# EAGLE schematic PDM (EAGLE 6.5.0)
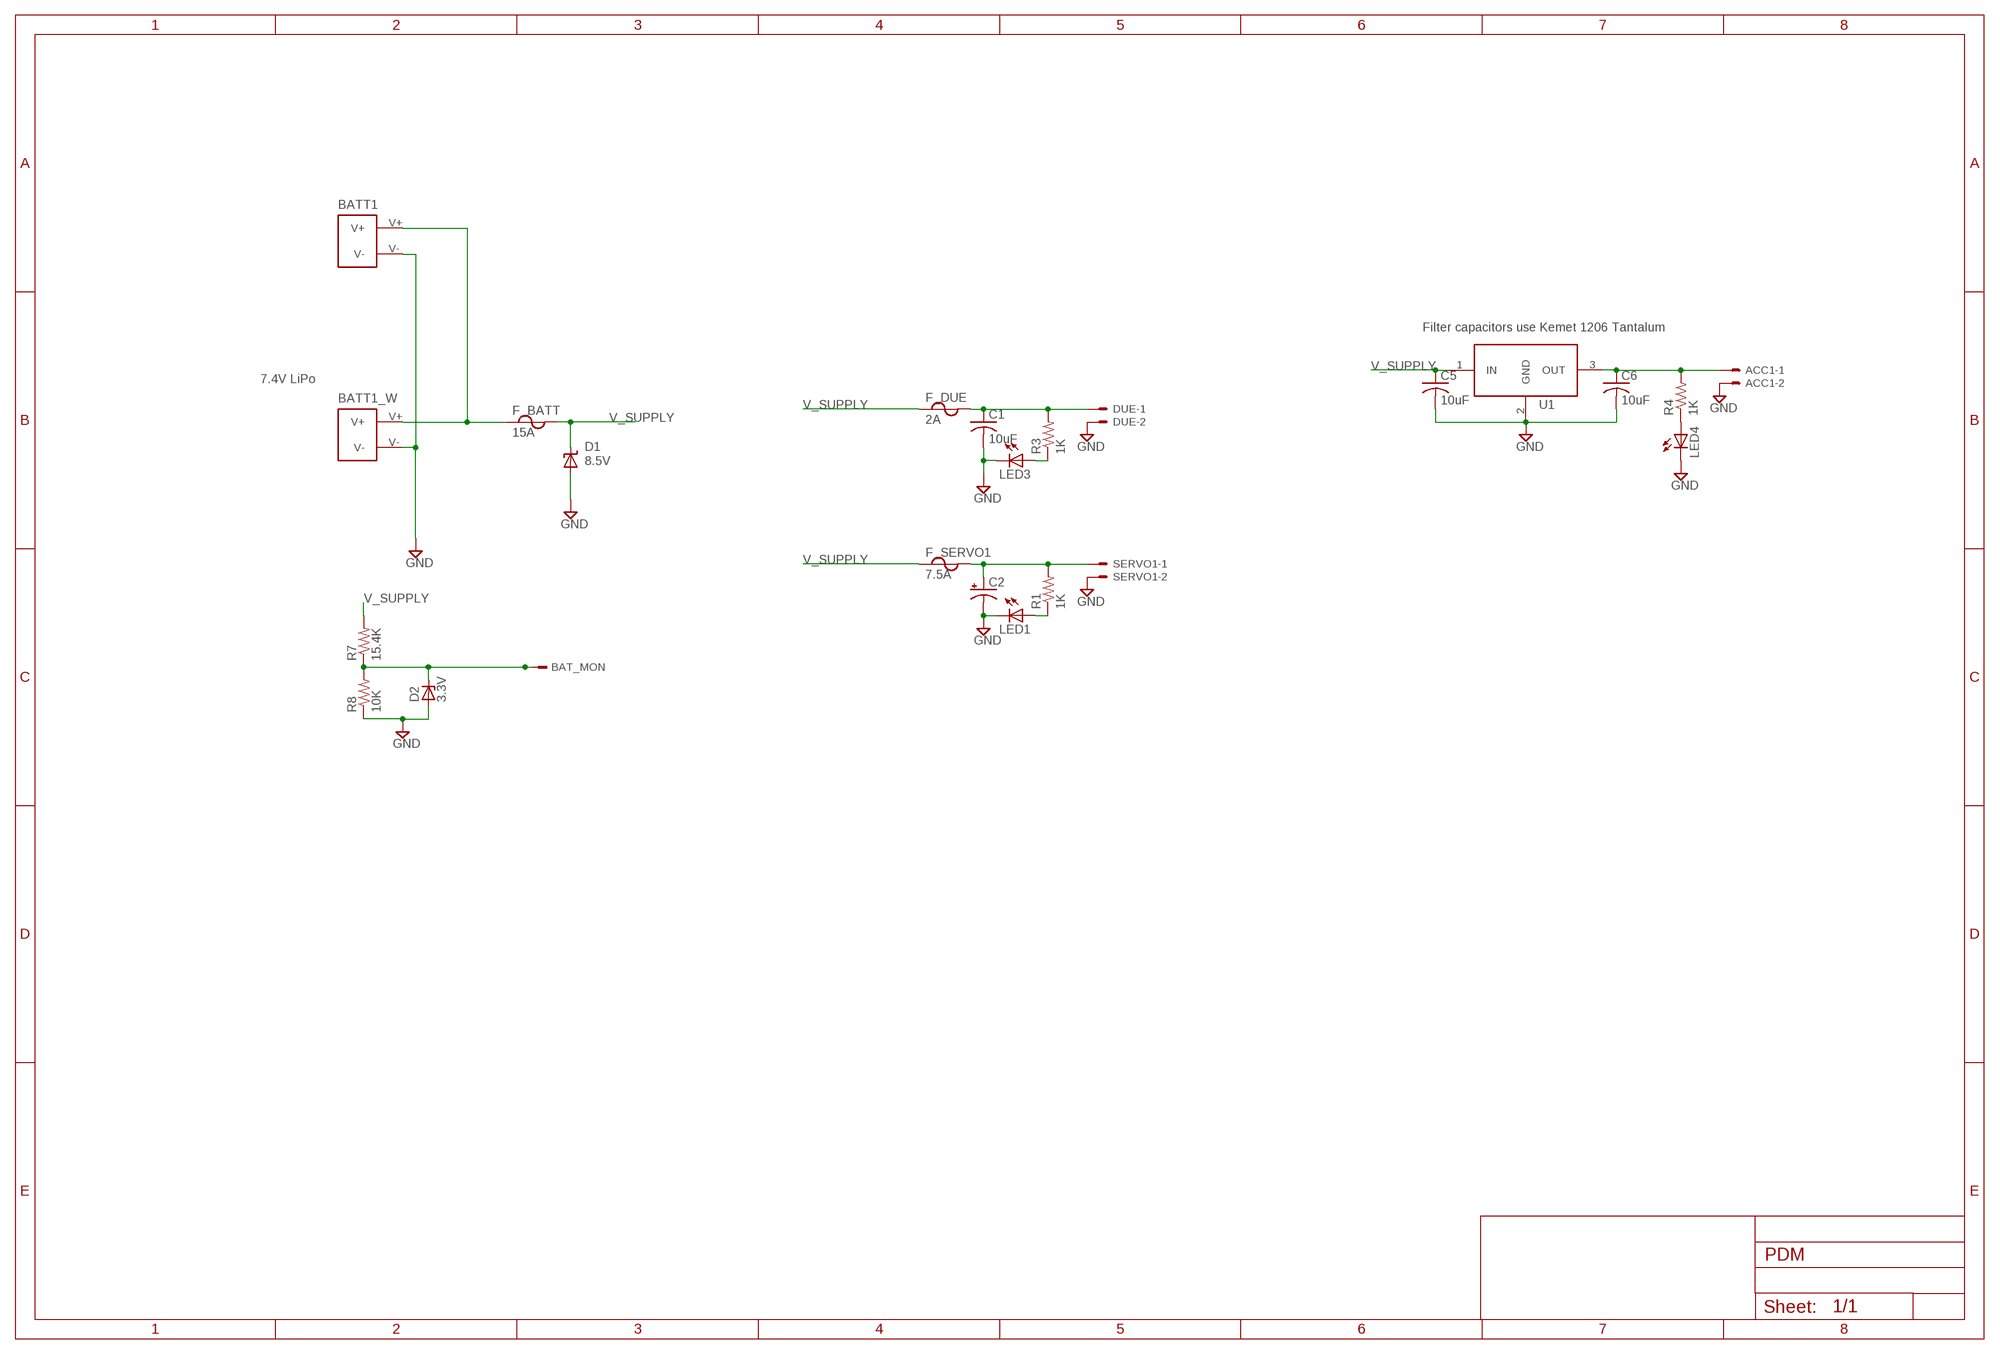
[diagram p0: schematic, sheet 1]

## Parts
ACC1  5566-2  [5566-2]
BAT_MON  TSW-101-02-S-S  [TSW-101-02-S-S]
BATT1  CON_XT60-PCB_MOUNT  [CON_XT60_PCB_MOUNT]
BATT1_W  CON_XT60-PIGTAIL  [CON_XT60_PIGTAIL]
C1  10uF  C-USC1206K  [C1206K]
C2  CPOL-USTT5D11  [TT5D11]
C5  10uF  C-USC1206K  [C1206K]
C6  10uF  C-USC1206K  [C1206K]
D1  8.5V  SUPPRESSOR-SMBJ  [SMBJ]
D2  3.3V  ZENER-DIODESMB  [SMB]
DUE  5566-2  [5566-2]
F_BATT  15A  FUSE-ATO  [ATO]
F_DUE  2A  FUSE-ATO  [ATO]
F_SERVO1  7.5A  FUSE-ATO  [ATO]
LED1  LEDSML1206  [SML1206]
LED3  LEDSML1206  [SML1206]
LED4  LEDSML1206  [SML1206]
R1  1K  R-US_R1206  [R1206]
R3  1K  R-US_R1206  [R1206]
R4  1K  R-US_R1206  [R1206]
R7  15.4K  R-US_R1206  [R1206]
R8  10K  R-US_R1206  [R1206]
SERVO1  5566-2  [5566-2]
U1  MIC29150/29300/29500VERTICAL  [TO220V]

## Nets
GND: ACC1.2 BATT1.V- BATT1_W.V- C1.2 C2.- C5.2 C6.2 D1.A D2.A DUE.2 LED1.C LED3.C LED4.C R8.1 SERVO1.2 U1.2(GND)
N$2: BATT1.V+ BATT1_W.V+ F_BATT.A1 F_BATT.A2 F_BATT.A3 F_BATT.A4
N$4: C1.1 DUE.1 F_DUE.B1 F_DUE.B2 F_DUE.B3 F_DUE.B4 R3.2
N$5: LED1.A R1.1
N$6: ACC1.1 C6.1 R4.2 U1.3(OUT)
N$11: LED3.A R3.1
N$13: LED4.A R4.1
N$15: C2.+ F_SERVO1.B1 F_SERVO1.B2 F_SERVO1.B3 F_SERVO1.B4 R1.2 SERVO1.1
N$18: BAT_MON.1 D2.C R7.1 R8.2
V_SUPPLY: C5.1 D1.C F_BATT.B1 F_BATT.B2 F_BATT.B3 F_BATT.B4 F_DUE.A1 F_DUE.A2 F_DUE.A3 F_DUE.A4 F_SERVO1.A1 F_SERVO1.A2 F_SERVO1.A3 F_SERVO1.A4 R7.2 U1.1(IN)

## Notes on the sheet
- Filter capacitors use Kemet 1206 Tantalum
- 7.4V LiPo

## Library data of the parts
ACC1 DUE SERVO1 = con-molex:5566-2: Mini FIT connector 2 pol Source: http://www.molex.com; OC_FARNELL: 1822072; OC_NEWARK: unknown
BAT_MON = con-samtec:TSW-101-02-S-S: THROUGH-HOLE .025" SQ POST HEADER Source: Samtec TSW.pdf; OC_FARNELL: unknown; OC_NEWARK: unknown
BATT1 BATT1_W = MRSDTeamB:CON_XT60-
C1 C5 C6 = rcl:C-US: CAPACITOR, American symbol
C2 = rcl:CPOL-US: POLARIZED CAPACITOR, American symbol
D1 = MRSDTeamB:SUPPRESSOR-: Suppressor diode
D2 = diode:ZENER-DIODE: Z-Diode
F_BATT F_DUE F_SERVO1 = MRSDTeamB:FUSE-: Automotive Fuse, PCB Mount Digikey <http://www.digikey.com/product-detail/en/178.6165.0002/WK6265-ND/653477> Datasheet <http://www.littelfuse.com/data/en/Data_Sheets/Littelfuse_ATO-PCB-Fuse-holders-178.6765.pdf> Library Part by Nate Chapman
LED1 LED3 LED4 = led:LED: LED OSRAM: - CHIPLED LG R971, LG N971, LY N971, LG Q971, LY Q971, LO R971, LY R971 LH N974, LH R974 LS Q976, LO Q976, LY Q976 LO Q996 - Hyper CHIPLED LW Q18S LB Q993, LB Q99A, LB R99A - SideLED LS A670, LO A670, LY A670, LG A670, LP A670 LB A673, LV A673, LT A673, LW A673 LH A674 LY A675 LS A676, LA A676, LO A676, LY A676, LW A676 LS A679, LY A679, LG A679 - Hyper Micro SIDELED® LS Y876, LA Y876, LO Y876, LY Y876 LT Y87S - SmartLED LW L88C, LW L88S LB L89C, LB L89S, LG L890 LS L89K, LO L89K, LY L89K LS L896, LA L896, LO L896, LY L896 - TOPLED LS T670, LO T670, LY T670, LG T670, LP T670 LSG T670, LSP T670, LSY T670, LOP T670, LYG T670 LG T671, LOG T671, LSG T671 LB T673, LV T673, LT T673, LW T673 LH T674 LS T676, LA T676, LO T676, LY T676, LB T676, LH T676, LSB T676, LW T676 LB T67C, LV T67C, LT T67C, LS T67K, LO T67K, LY T67K, LW E67C LS E67B, LA E67B, LO E67B, LY E67B, LB E67C, LV E67C, LT E67C LW T67C LS T679, LY T679, LG T679 LS T770, LO T770, LY T770, LG T770, LP T770 LB T773, LV T773, LT T773, LW T773 LH T774 LS E675, LA E675, LY E675, LS T675 LS T776, LA T776, LO T776, LY T776, LB T776 LHGB T686 LT T68C, LB T68C - Hyper Mini TOPLED® LB M676 - Mini TOPLED Santana® LG M470 LS M47K, LO M47K, LY M47K Source: http://www.osram.convergy.de LUXEON: - LUMILED® LXK2-PW12-R00, LXK2-PW12-S00, LXK2-PW14-U00, LXK2-PW14-V00 LXK2-PM12-R00, LXK2-PM12-S00, LXK2-PM14-U00 LXK2-PE12-Q00, LXK2-PE12-R00, LXK2-PE12-S00, LXK2-PE14-T00, LXK2-PE14-U00 LXK2-PB12-K00, LXK2-PB12-L00, LXK2-PB12-M00, LXK2-PB14-N00, LXK2-PB14-P00, LXK2-PB14-Q00 LXK2-PR12-L00, LXK2-PR12-M00, LXK2-PR14-Q00, LXK2-PR14-R00 LXK2-PD12-Q00, LXK2-PD12-R00, LXK2-PD12-S00 LXK2-PH12-R00, LXK2-PH12-S00 LXK2-PL12-P00, LXK2-PL12-Q00, LXK2-PL12-R00 Source: www.luxeon.com KINGBRIGHT: KA-3528ASYC Source: www.kingbright.com
R1 R3 R4 R7 R8 = rcl:R-US_: RESISTOR, American symbol
U1 = MRSDTeamB:MIC29150/29300/29500